# Altium schematic sheet programmer_charger.SchDoc: Opo8001
size Letter; Author: William W. Huang; Organization: Altium Limited; Address1: L3, 12a Rodborough Rd; Address2: Frenchs Forest; Address3: NSW; Address4: Australia 2086; Revision: 2
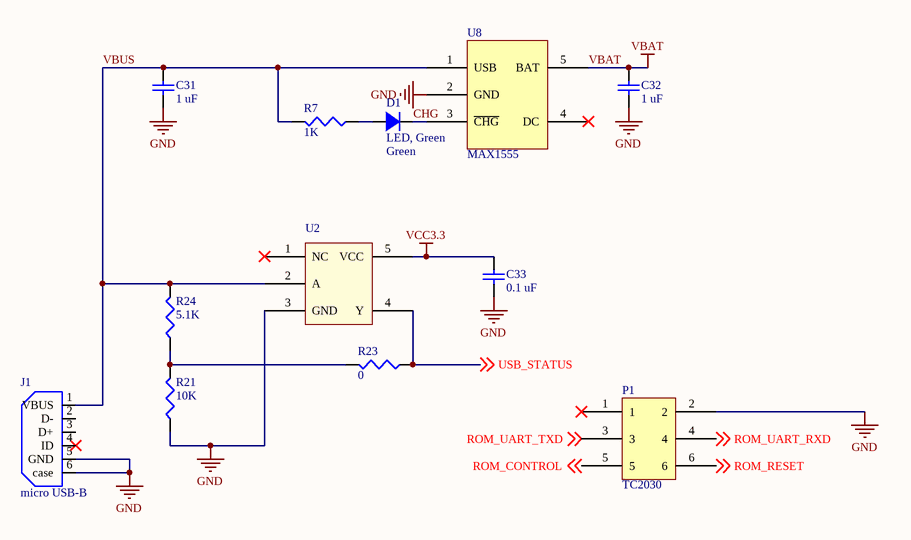
[diagram p0: programmer_charger.SchDoc]

## Parts
C31  value 1 uF  [0402]  (hidden comment: Ceramic capacitor)
C32  value 1 uF  [0402]  (hidden comment: Ceramic capacitor)
C33  value 0.1 uF  [0402]  (hidden comment: Ceramic capacitor)
D1  LED, Green  Color: Green  [0402 - DIODE]
J1  micro USB-B  [Micro USB-B]
P1  TC2030  [TC2030-IDC-NLFP]
R7  value 1K  [0402]  (hidden comment: Chip resistor)
R21  value 10K  [0402]  (hidden comment: Chip resistor)
R23  value 0  [0402]  (hidden comment: Chip resistor)
R24  value 5.1K  [0402]  (hidden comment: Chip resistor)
U2  74LVC1G34GW  [SC-70-5 (DCK)]  (value not drawn)
U8  MAX1555  [SOT23-5]

## Nets
GND: C31.2 C32.2 C33.2 J1.5(GND) J1.6(case) P1.2 R21.2 U2.3(GND) U8.2(GND)
VBAT: C32.1 U8.5(BAT)
VCC3.3: C33.1 U2.5(VCC)
CHG: D1.2 U8.3(~{CHG})
ROM_CONTROL: P1.5 ; off-sheet ROM_CONTROL
ROM_RESET: P1.6 ; off-sheet ROM_RESET
ROM_UART_RXD: P1.4 ; off-sheet ROM_UART_RXD
ROM_UART_TXD: P1.3 ; off-sheet ROM_UART_TXD
USB_STATUS: R23.2 U2.4(Y) ; off-sheet USB_STATUS
VBUS: C31.1 J1.1(VBUS) R7.1 R24.1 U2.2(A) U8.1(USB)
NetD1_1: D1.1 R7.2
NetR21_1: R21.1 R23.1 R24.2

Not connected (* = marked no-connect by the designer): J1 2(D-) 3(D+) 4(ID)*; P1 1*; U2 1(NC)*; U8 4(DC)*

## Notes on the sheet
- Title
- Date:
- Author:
- Revision:
- Sheet
- of
- University of Michigan
- File:

## Library data of the parts
C31 C32 = C_1u_0402_ceramic: Ceramic capacitor, 1 uF, 0402 package; Manufacture: TDK; voltage rated: 6.3 V; tolerance: 10%; package: 0402; Supplier 1: Digi-Key; Supplier Part Number 1: 445-5000-1-ND
C33 = C_0.1u_0402_ceramic: Ceramic capacitor, 0.1u, 0402 package; Manufacture: TDK; voltage rated: 10 V; tolerance: 10%; Supplier 1: Digi-Key; Supplier Part Number 1: 445-1265-1-ND; package: 0402
D1 = D_LED_GREEN_0402: LED, Green,  0402; package: 0402; Supplier 1: Digi-Key; Supplier Part Number 1: 511-1592-1-ND
J1 = Micro USB: CONN USB MICRO B RECPT SMT R/A; Supplier 1: Digi-Key; Supplier Part Number 1: 609-4616-6-ND
P1 = TC2030: TC2030-MCP-NL
R7 = R_1K_0402: Chip resistor, 1K, 0402 package; tolerance: 1%; power: 1/16 W; Supplier 1: Digi-Key; Supplier Part Number 1: 541-1.00KLCT-ND; package: 0402
R21 = R_10K_0402: Chip resistor, 10K, 0402 package; tolerance: 1%; power: 1/16 W; Supplier 1: Digi-Key; Supplier Part Number 1: 541-10.0KLDKR-ND; package: 0402
R23 = R_0_0402: Chip resistor, 0, 0402 package; package: 0402; Supplier 1: Digi-Key; Supplier Part Number 1: 541-0.0YBCT-ND
R24 = R_5.1K_0402_1: Chip resistor, 5.1K,  0402 package; tolerance: .5%; power: 1/16 W; package: 0402; Supplier 1: Digi-Key; Supplier Part Number 1: RR05P5.1KDCT-ND
U2 = 74LVC1G34GW: Low power single buffer; Supplier 1: DIgikey; Supplier Part Number 1: 568-7766-1-ND
U8 = MAX1555: 3 Dual-Input USB/AC Adapter 1-Cell Li+  Battery Chargers; Supplier 1: Digi-Key; Supplier Part Number 1: MAX1555EZK+TTR-ND